# Altium project R2D.PrjPcb
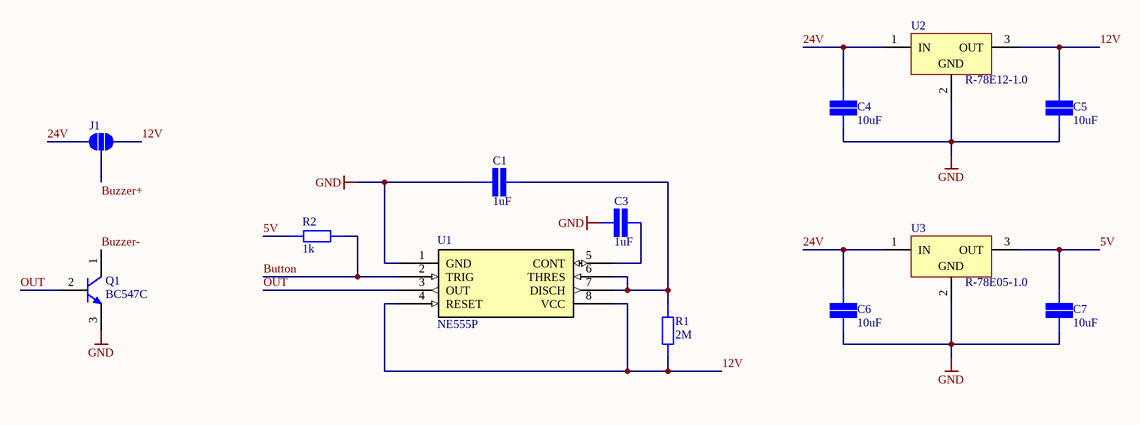
[diagram p0: R2D.SchDoc]
1 sheet, 13 parts. Net scope: global (net labels, ports and power ports of the same name join across sheets).
Board file: R2D.PcbDoc

## Sheet R2D.SchDoc
size A3; SheetNumber: 1; SheetTotal: 1

### Parts
C1  value 1uF  [CAP 0603/1608]  (hidden comment: SMD Capacitor)
C3  value 1uF  [CAP 0603/1608]  (hidden comment: SMD Capacitor)
C4  value 10uF  [CAP 0603/1608]  (hidden comment: SMD Capacitor)
C5  value 10uF  [CAP 0603/1608]  (hidden comment: SMD Capacitor)
C6  value 10uF  [CAP 0603/1608]  (hidden comment: SMD Capacitor)
C7  value 10uF  [CAP 0603/1608]  (hidden comment: SMD Capacitor)
J1  JUMPERID  [SMD-JUMPER-3]  (value not drawn)  (net tie, no BOM)
Q1  BC547C  [ONSC-TO-92-3-29-11]
R1  value 2M  [STACKPOLE CSR0603]  (hidden comment: SMD Resistor)
R2  value 1k  [STACKPOLE CSR0603]  (hidden comment: SMD Resistor)
U1  NE555P  [NE555P]
U2  R-78E12-1.0  [SIP3_RECOM]
U3  R-78E05-1.0  [SIP3_RECOM]

### Nets
GND: C1.2 C3.2 C4.2 C5.2 C6.2 C7.2 Q1.3(E) U1.1(GND) U2.2(GND) U3.2(GND)
5V: C7.1 R2.2 U3.3(OUT)
12V: C5.1 J1.1 R1.1 U1.4(RESET) U1.8(VCC) U2.3(OUT)
24V: C4.1 C6.1 J1.3 U2.1(IN) U3.1(IN)
Button: R2.1 U1.2(TRIG)
Buzzer+: J1.2
Buzzer-: Q1.1(C)
OUT: Q1.2(B) U1.3(OUT)
NetC1_1: C1.1 R1.2 U1.6(THRES) U1.7(DISCH)
NetC3_1: C3.1 U1.5(CONT)

### Library data of the parts
C1 C3-C7 = SMD Capacitor: Capacitor with multiple Footprints
J1 = SMD Jumper 3
Q1 = CMP-1048-01437-1: Amplifier Transistor, NPN Silicon, 3-Pin TO-92, Bulk Box; Manufacturer: On Semiconductor; IC Continuous (A): 0.1; fT Min (MHz): 150; Mounting Technology: Through Hole; ComponentLink1URL: http://www.onsemi.com/; ComponentLink1Description: Manufacturer URL; ComponentLink3URL: http://www.onsemi.cn/pub_link/Collateral/2N6426-D.PDF; DatasheetVersion: Rev. 7; PackageVersion: Rev. AM; Packing: Bulk Box; RoHS: FALSE; Polarity: NPN; PartNumber: BC547C; ComponentLink2URL: http://www.onsemi.com/pub_link/Collateral/BC546-D.PDF; ComponentLink3Description: Package Specification; PackageDescription: 3-Pin Transistor Outline, Body 4.825 x 3.685 mm, Pitch 1.27 mm; PackageReference: TO-92-3-29-11_AM_SL; ComponentLink2Description: Datasheet
R1 R2 = SMD Resistor: Resistor with multiple footprints
U1 = NE555P: Zeitgeber
U2 U3 = R-78E05-1.0: Nonisolated 5V Switchmode converter